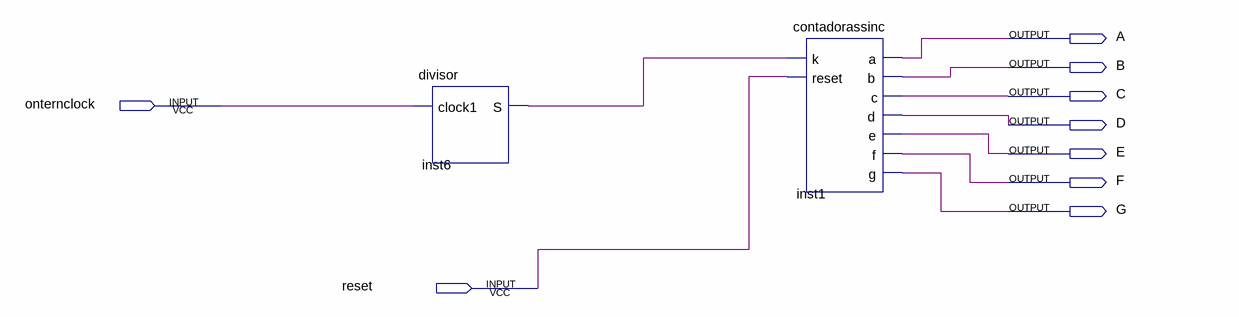
[diagram p0: schematic sheet]
// Quartus schematic contadorautom.bdf as structural Verilog: 2 symbols, 9 pins
module contadorautom (
  input  onternclock,
  input  reset,
  output A,
  output B,
  output C,
  output D,
  output E,
  output F,
  output G
);

  wire inst6_s;

  divisor inst6 (.clock1(onternclock), .S(inst6_s));
  contadorassinc inst1 (.k(inst6_s), .reset(reset), .a(A), .b(B), .c(C), .d(D), .e(E), .f(F), .g(G));
endmodule
